# EAGLE design Xor_Not (EAGLE 7.6.0)
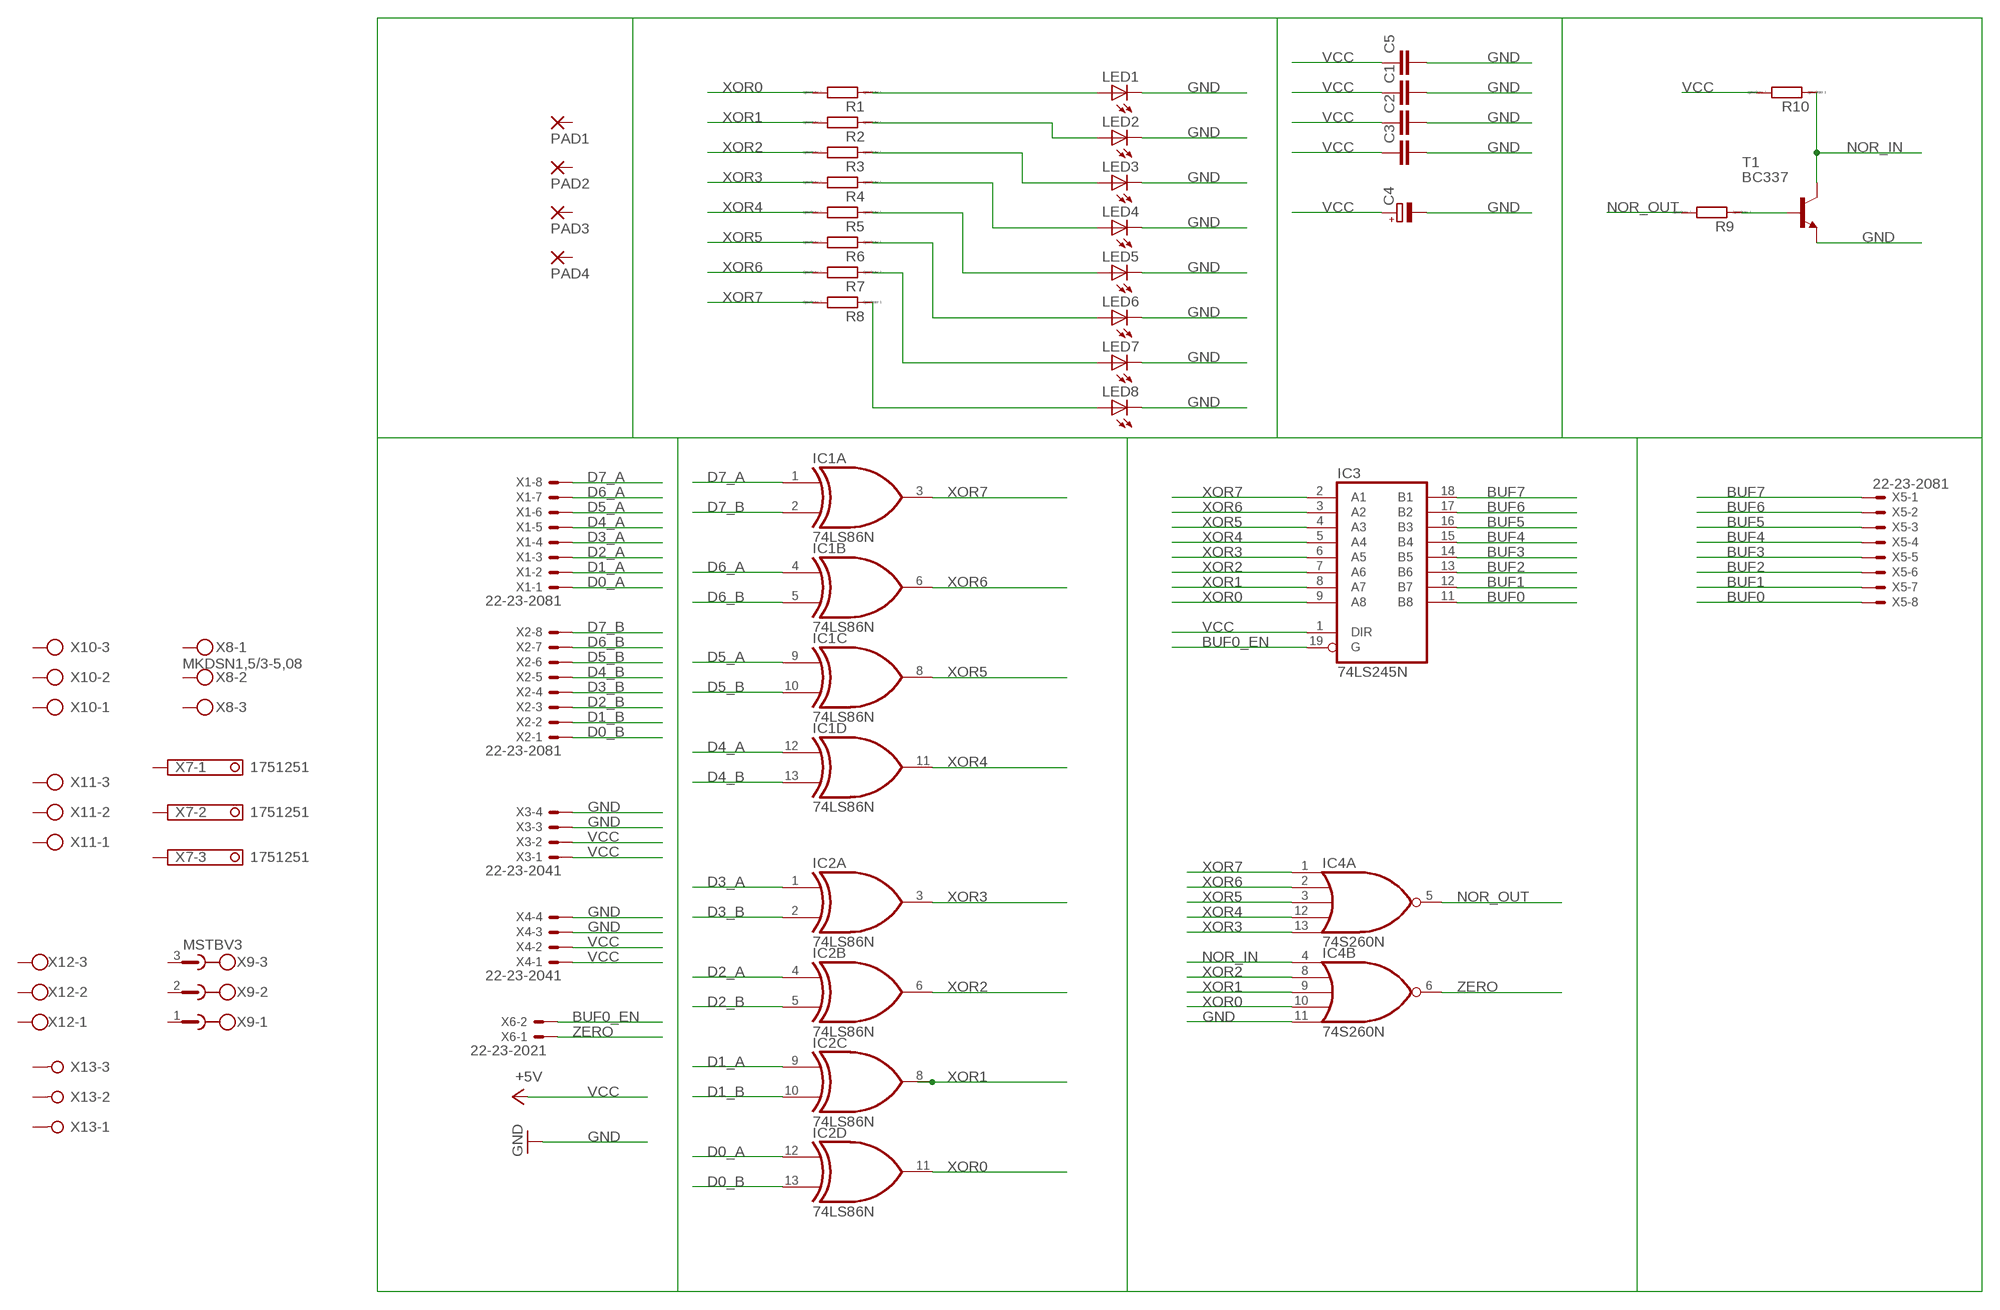
[diagram p0: schematic, sheet 1]

## Parts
C1  C-EU025-025X050  [C025-025X050]
C2  C-EU025-025X050  [C025-025X050]
C3  C-EU025-025X050  [C025-025X050]
C4  CPOL-EUE2.5-6  [E2,5-6]
C5  C-EU025-025X050  [C025-025X050]
IC1  74LS86N  [DIL14]
IC2  74LS86N  [DIL14]
IC3  74LS245N  [DIL20]
IC4  74S260N  [DIL14]
LED1  LED5MM  [LED5MM]
LED2  LED5MM  [LED5MM]
LED3  LED5MM  [LED5MM]
LED4  LED5MM  [LED5MM]
LED5  LED5MM  [LED5MM]
LED6  LED5MM  [LED5MM]
LED7  LED5MM  [LED5MM]
LED8  LED5MM  [LED5MM]
PAD1  3,17/1,3  [3,17/1,3]
PAD2  3,17/1,3  [3,17/1,3]
PAD3  3,17/1,3  [3,17/1,3]
PAD4  3,17/1,3  [3,17/1,3]
R1  R0207/10  [0207/10]
R2  R0207/10  [0207/10]
R3  R0207/10  [0207/10]
R4  R0207/10  [0207/10]
R5  R0207/10  [0207/10]
R6  R0207/10  [0207/10]
R7  R0207/10  [0207/10]
R8  R0207/10  [0207/10]
R9  R0207/10  [0207/10]
R10  R0207/10  [0207/10]
T1  BC337  [TO92]
X1  22-23-2081  [22-23-2081]
X2  22-23-2081  [22-23-2081]
X3  22-23-2041  [22-23-2041]
X4  22-23-2041  [22-23-2041]
X5  22-23-2081  [22-23-2081]
X6  22-23-2021  [22-23-2021]
X7  1751251  [1751251]
X8  MKDSN1,5/3-5,08  [MKDSN1,5/3-5,08]
X9  MSTBV3  [MSTBV3]
X10  AK300/3  [AK300/3]
X11  AK500/3-H  [AK500/3-H]
X12  W237-103  [W237-103]
X13  W237-03P  [W237-133]

## Nets
BUF0: IC3.11(B8) X5.8
BUF0_EN: IC3.19(G) X6.2
BUF1: IC3.12(B7) X5.7
BUF2: IC3.13(B6) X5.6
BUF3: IC3.14(B5) X5.5
BUF4: IC3.15(B4) X5.4
BUF5: IC3.16(B3) X5.3
BUF6: IC3.17(B2) X5.2
BUF7: IC3.18(B1) X5.1
D0_A: IC2.12(D:I0) X1.1
D0_B: IC2.13(D:I1) X2.1
D1_A: IC2.9(C:I0) X1.2
D1_B: IC2.10(C:I1) X2.2
D2_A: IC2.4(B:I0) X1.3
D2_B: IC2.5(B:I1) X2.3
D3_A: IC2.1(A:I0) X1.4
D3_B: IC2.2(A:I1) X2.4
D4_A: IC1.12(D:I0) X1.5
D4_B: IC1.13(D:I1) X2.5
D5_A: IC1.9(C:I0) X1.6
D5_B: IC1.10(C:I1) X2.6
D6_A: IC1.4(B:I0) X1.7
D6_B: IC1.5(B:I1) X2.7
D7_A: IC1.1(A:I0) X1.8
D7_B: IC1.2(A:I1) X2.8
GND [suply]: C1.2 C2.2 C3.2 C4.- C5.2 IC4.11(B:I4) LED1.K(C) LED2.K(C) LED3.K(C) LED4.K(C) LED5.K(C) LED6.K(C) LED7.K(C) LED8.K(C) T1.1(E) X3.3 X3.4 X4.3 X4.4
N$15: R9.1 T1.2(B)
N$74: LED1.A R1.1
N$75: LED2.A R2.1
N$76: LED3.A R3.1
N$77: LED4.A R4.1
N$78: LED5.A R5.1
N$79: LED6.A R6.1
N$80: LED7.A R7.1
N$81: LED8.A R8.1
NOR_IN: IC4.4(B:I0) R10.1 T1.3(C)
NOR_OUT: IC4.5(A:O) R9.2
VCC [suply]: C1.1 C2.1 C3.1 C4.+ C5.1 IC3.1(DIR) R10.2 X3.1 X3.2 X4.1 X4.2 ; supply symbol labelled +5V
XOR0: IC2.11(D:O) IC3.9(A8) IC4.10(B:I3) R1.2
XOR1: IC2.8(C:O) IC3.8(A7) IC4.9(B:I2) R2.2
XOR2: IC2.6(B:O) IC3.7(A6) IC4.8(B:I1) R3.2
XOR3: IC2.3(A:O) IC3.6(A5) IC4.13(A:I4) R4.2
XOR4: IC1.11(D:O) IC3.5(A4) IC4.12(A:I3) R5.2
XOR5: IC1.8(C:O) IC3.4(A3) IC4.3(A:I2) R6.2
XOR6: IC1.6(B:O) IC3.3(A2) IC4.2(A:I1) R7.2
XOR7: IC1.3(A:O) IC3.2(A1) IC4.1(A:I0) R8.2
ZERO: IC4.6(B:O) X6.1
Unconnected: PAD1.1(P) PAD2.1(P) PAD3.1(P) PAD4.1(P) X7.1 X7.2 X7.3 X8.1 X8.2 X8.3 X9.1 X9.2 X9.3 X10.1 X10.2 X10.3 X11.1 X11.2 X11.3 X12.1 X12.2 X12.3 X13.1 X13.2 X13.3

## Power pins joined to a net without a drawn wire
GND: IC1.7(P:GND) IC2.7(P:GND) IC3.10(GND) IC4.7(P:GND)
VCC: IC1.14(P:VCC) IC2.14(P:VCC) IC3.20(VCC) IC4.14(P:VCC)

## Library data of the parts
C1-C3 C5 = resistor:C-EU: CAPACITOR, European symbol
C4 = resistor:CPOL-EU: POLARIZED CAPACITOR, European symbol
IC1 IC2 = 74xx-us:74*86: Quad 2-input EXCLUSIV-OR (XOR) gate
IC3 = 74xx-us:74*245: Octal BUS TRANSCEIVER, 3-state
IC4 = 74xx-us:74*260: Dual 5-input positive NOR gate
LED1-LED8 = led:LED: LED OSRAM: - CHIPLED LG R971, LG N971, LY N971, LG Q971, LY Q971, LO R971, LY R971 LH N974, LH R974 LS Q976, LO Q976, LY Q976 LO Q996 - Hyper CHIPLED LW Q18S LB Q993, LB Q99A, LB R99A - SideLED LS A670, LO A670, LY A670, LG A670, LP A670 LB A673, LV A673, LT A673, LW A673 LH A674 LY A675 LS A676, LA A676, LO A676, LY A676, LW A676 LS A679, LY A679, LG A679 - Hyper Micro SIDELED® LS Y876, LA Y876, LO Y876, LY Y876 LT Y87S - SmartLED LW L88C, LW L88S LB L89C, LB L89S, LG L890 LS L89K, LO L89K, LY L89K LS L896, LA L896, LO L896, LY L896 - TOPLED LS T670, LO T670, LY T670, LG T670, LP T670 LSG T670, LSP T670, LSY T670, LOP T670, LYG T670 LG T671, LOG T671, LSG T671 LB T673, LV T673, LT T673, LW T673 LH T674 LS T676, LA T676, LO T676, LY T676, LB T676, LH T676, LSB T676, LW T676 LB T67C, LV T67C, LT T67C, LS T67K, LO T67K, LY T67K, LW E67C LS E67B, LA E67B, LO E67B, LY E67B, LB E67C, LV E67C, LT E67C LW T67C LS T679, LY T679, LG T679 LS T770, LO T770, LY T770, LG T770, LP T770 LB T773, LV T773, LT T773, LW T773 LH T774 LS E675, LA E675, LY E675, LS T675 LS T776, LA T776, LO T776, LY T776, LB T776 LHGB T686 LT T68C, LB T68C - Hyper Mini TOPLED® LB M676 - Mini TOPLED Santana® LG M470 LS M47K, LO M47K, LY M47K Source: http://www.osram.convergy.de LUXEON: - LUMILED® LXK2-PW12-R00, LXK2-PW12-S00, LXK2-PW14-U00, LXK2-PW14-V00 LXK2-PM12-R00, LXK2-PM12-S00, LXK2-PM14-U00 LXK2-PE12-Q00, LXK2-PE12-R00, LXK2-PE12-S00, LXK2-PE14-T00, LXK2-PE14-U00 LXK2-PB12-K00, LXK2-PB12-L00, LXK2-PB12-M00, LXK2-PB14-N00, LXK2-PB14-P00, LXK2-PB14-Q00 LXK2-PR12-L00, LXK2-PR12-M00, LXK2-PR14-Q00, LXK2-PR14-R00 LXK2-PD12-Q00, LXK2-PD12-R00, LXK2-PD12-S00 LXK2-PH12-R00, LXK2-PH12-S00 LXK2-PL12-P00, LXK2-PL12-Q00, LXK2-PL12-R00 Source: www.luxeon.com KINGBRIGHT: KA-3528ASYC Source: www.kingbright.com
PAD1-PAD4 = wirepad:3,17/1,3: THROUGH-HOLE PAD
R1-R10 = eagle-ltspice:R: RESISTOR, European symbol; SPICEMODEL: NONE; SPICEPREFIX: R
T1 = transistor:BC337: NPN TRANSISTOR
X1 X2 X5 = con-molex:22-23-2081: .100" (2.54mm) Center Header - 8 Pin; MF: MOLEX; MPN: 22-23-2081; OC_FARNELL: 1756826; OC_NEWARK: 01C7592
X3 X4 = con-molex:22-23-2041: .100" (2.54mm) Center Header - 4 Pin; MF: MOLEX; MPN: 22-23-2041; OC_FARNELL: 1462920; OC_NEWARK: 38C0355
X6 = con-molex:22-23-2021: .100" (2.54mm) Center Header - 2 Pin; MF: MOLEX; MPN: 22-23-2021; OC_FARNELL: 1462926; OC_NEWARK: 25C3832
X7 = con-phoenix-350:1751251: MKDS 1/ 3-3,5 Printklemme Nennstrom: 10 A Bemessungsspannung: 160 V Raster: 3,5 mm Polzahl: 3 Montageart: Löten Anschlussart: Schraubanschluss Anschlussrichtung vom Leiter zur Platine: 0° Source: http://eshop.phoenixcontact.com .. 1751251.pdf; OC_FARNELL: unknown; OC_NEWARK: unknown
X8 = con-phoenix-508:MKDSN1,5/3-5,08: MKDSN 1,5/ 3-5,08 Printklemme Nennstrom: 13,5 A Nennspannung: 250 V Rastermaß: 5,08 mm Polzahl: 3 Anschlussart: Schraubanschluss Montage: Löten Anschlussrichtung Leiter/Platine: 0 ° Artikelnummer: 1729131 Source: http://eshop.phoenixcontact.com .. 1729131.pdf
X9 = con-phoenix-508:MSTBV3: PHOENIX; MPN: MSTBV 2,5/3-GF-5.08; OC_FARNELL: 1792793; OC_NEWARK: 69R9846
X10 = con-ptr500:AK300/3: CONNECTOR; OC_FARNELL: unknown; OC_NEWARK: unknown
X11 = con-ptr500:AK500/3-H: CONNECTOR Aug. 2004 / PTR Meßtechnik: Die Bezeichnung der Serie AK505 wurde geändert. Es handelt sich hierbei um AK500 in horizontaler Ausführung.; OC_FARNELL: unknown; OC_NEWARK: unknown
X12 = con-wago-500:W237-103: WAGO SCREW CLAMP; MPN: 237-103; OC_FARNELL: unknown; OC_NEWARK: 18M7116
X13 = con-wago-508:W237-03P: WAGO SREW CLAMP; OC_FARNELL: unknown; OC_NEWARK: unknown

## Net classes
1 suply: width 1.016 mm

## Board
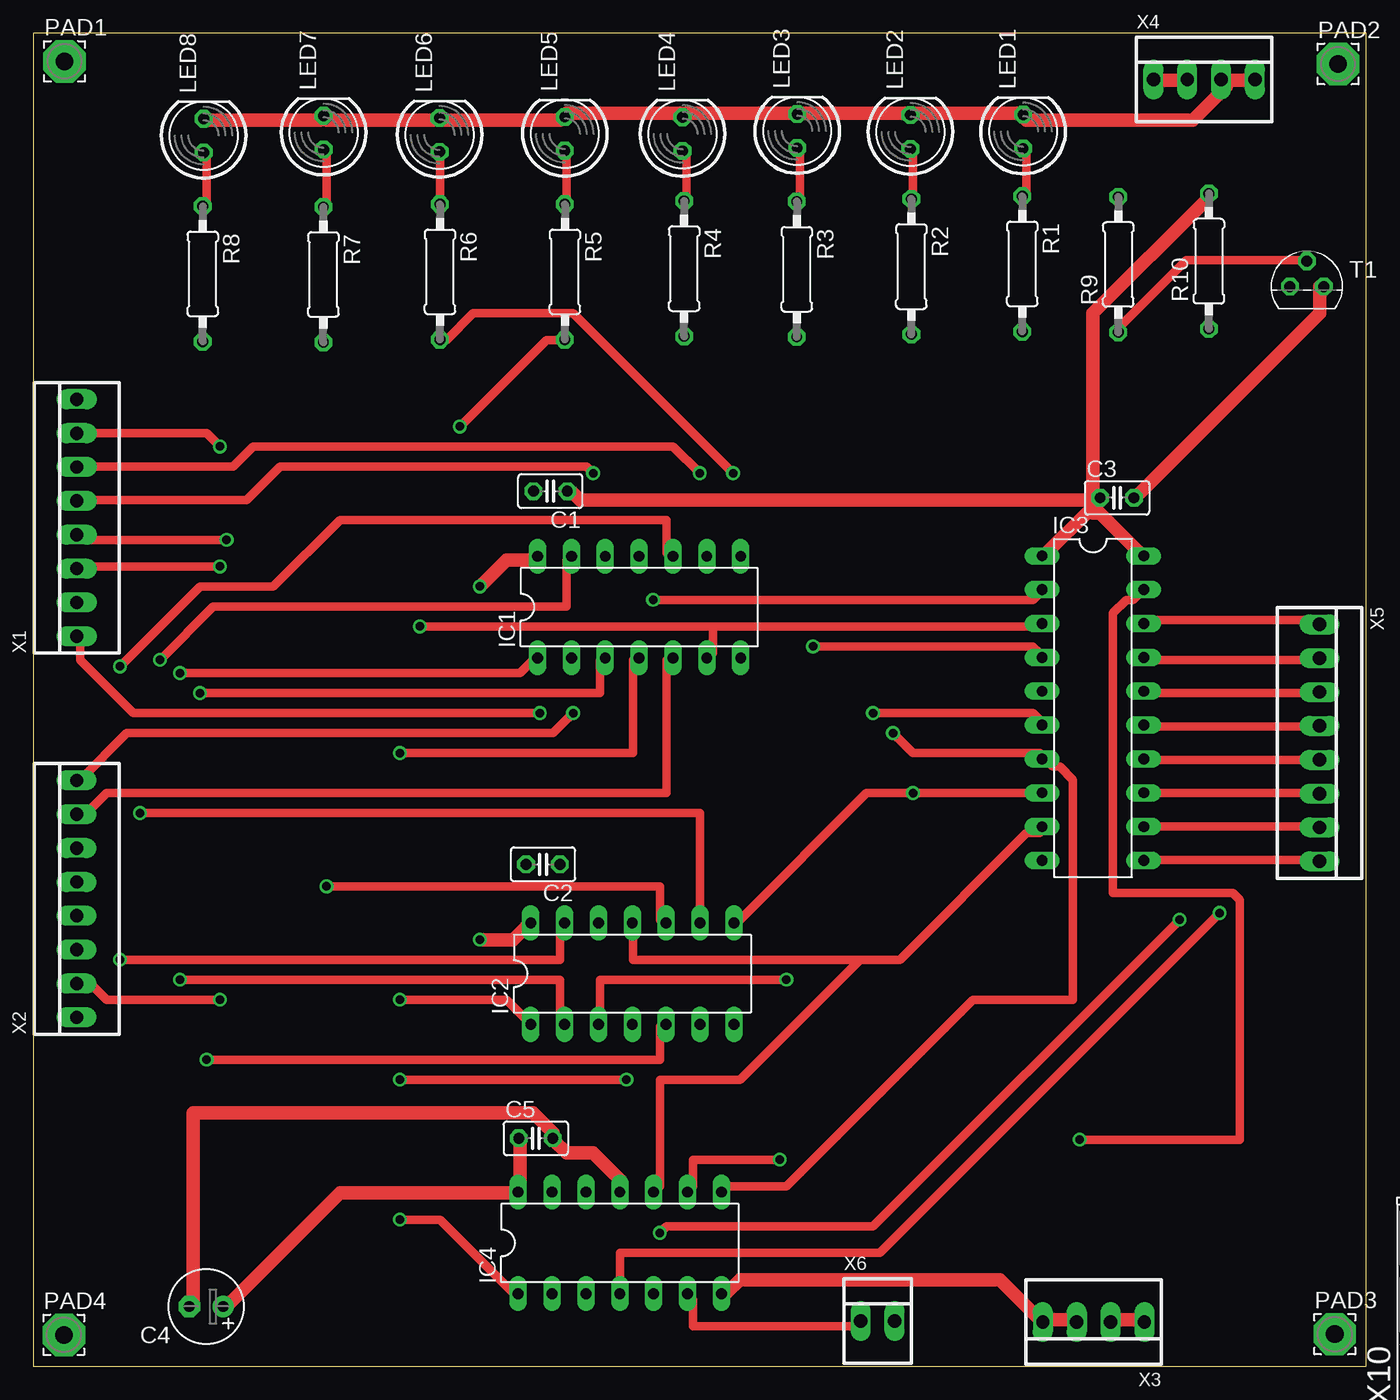
[diagram p1: board, top side]
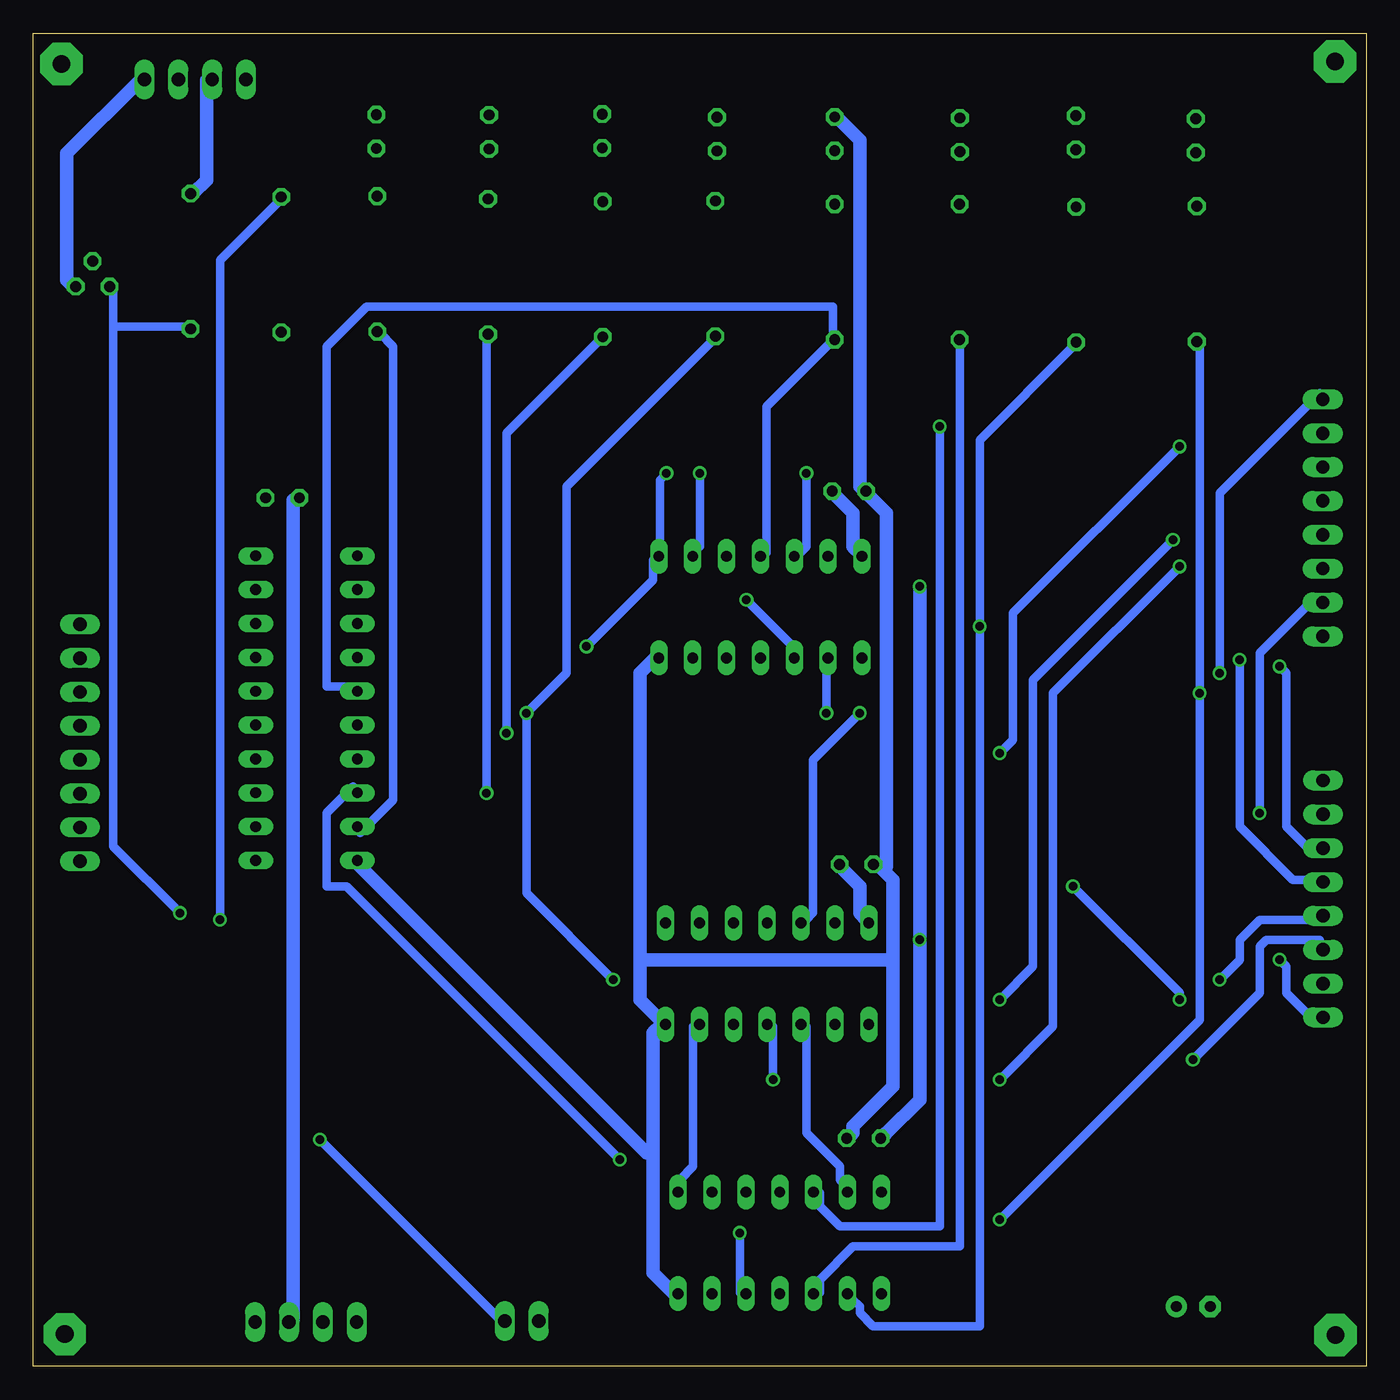
[diagram p2: board, bottom side, seen from below]

Size 100 x 100 mm. Coordinates in mm from the lower left corner, seen from the top.
Outline: 0,0 100,0 100,100 0,100 0,0
Copper layers (1*16): Top 0.035mm / dielectric 1.5mm / Bottom 0.035mm
Design rules "default *": minimum track width 25mil, minimum drill 25mil, track to track 25mil, track to pad 25mil, pad to pad 25mil, via to via 25mil, smd to smd 8mil, copper to edge 40mil, drill to drill 8mil, minimum pad ring 10mil, minimum via ring 8mil, stop-mask expansion 4mil, vias tented up to drill 0mil, thermal gap 10mil

### Footprints (pad centres in the part's own frame; a part is rotated, then mirrored left to right if it is on the bottom)
C025-025X050 = drill 0.813 octagon: 1 -1.27,0; 2 1.27,0
E2,5-6 = drill 0.813 pad 1.6: + -1.27,0 | drill 0.813 pad 1.6 octagon: - 1.27,0
DIL14 = drill 0.813 long: 1 -7.62,-3.81; 2 -5.08,-3.81; 3 -2.54,-3.81; 4 0,-3.81; 5 2.54,-3.81; 6 5.08,-3.81; 7 7.62,-3.81; 8 7.62,3.81; 9 5.08,3.81; 10 2.54,3.81; 11 0,3.81; 12 -2.54,3.81; 13 -5.08,3.81; 14 -7.62,3.81
DIL20 = drill 0.813 long: 1 -11.43,-3.81; 2 -8.89,-3.81; 3 -6.35,-3.81; 4 -3.81,-3.81; 5 -1.27,-3.81; 6 1.27,-3.81; 7 3.81,-3.81; 8 6.35,-3.81; 9 8.89,-3.81; 10 11.43,-3.81; 11 11.43,3.81; 12 8.89,3.81; 13 6.35,3.81; 14 3.81,3.81; 15 1.27,3.81; 16 -1.27,3.81; 17 -3.81,3.81; 18 -6.35,3.81; 19 -8.89,3.81; 20 -11.43,3.81
LED5MM = drill 0.813 octagon: A -1.27,0; K 1.27,0
3,17/1,3 = drill 1.321 pad 3.175 octagon: 1 0,0
0207/10 = drill 0.813 octagon: 1 -5.08,0; 2 5.08,0
TO92 = drill 0.813 octagon: 1 1.27,0; 2 0,1.905; 3 -1.27,0
22-23-2081 = drill 1 long: 1 -8.89,0; 2 -6.35,0; 3 -3.81,0; 4 -1.27,0; 5 1.27,0; 6 3.81,0; 7 6.35,0; 8 8.89,0
22-23-2041 = drill 1 long: 1 -3.81,0; 2 -1.27,0; 3 1.27,0; 4 3.81,0
22-23-2021 = drill 1 long: 1 -1.27,0; 2 1.27,0
1751251 = drill 1.1 pad 1.7: 1 -3.5,-0.1; 2 0,-0.1; 3 3.5,-0.1
MKDSN1,5/3-5,08 = drill 1.3 pad 2: 1 -7.641,0.025; 2 -2.561,0.025; 3 2.519,0.025
MSTBV3 = drill 1.397 long: 1 -5.08,0; 2 0,0; 3 5.08,0
AK300/3 = drill 1.321 long: 1 -5.004,0; 2 0,0; 3 5.004,0
AK500/3-H = drill 1.321 long: 1 -5.004,0; 2 0,0; 3 5.004,0
W237-103 = drill 1.194 long: 1 -5,-1.29; 2 0,-1.29; 3 5,-1.29
W237-133 = drill 1.194 long: 1 -5.08,-0.635; 2 0,-0.635; 3 5.08,-0.635

### Placement (x,y rotation side)
C1  38.79,65.65 180 top
C2  38.24,37.65 180 top
C3  81.31,65.15 0 top
C4  12.97,4.48 180 top
C5  37.7,17.1 0 top
IC1  45.45,56.95 0 top
IC2  44.94,29.45 0 top
IC3  79.5,49.37 270 top
IC4  44,9.25 0 top
LED1  74.26,92.63 90 top
LED2  65.81,92.6 90 top
LED3  57.31,92.67 90 top
LED4  48.71,92.44 90 top
LED5  39.88,92.46 90 top
LED6  30.48,92.38 90 top
LED7  21.78,92.55 90 top
LED8  12.78,92.32 90 top
PAD1  2.34,97.9 0 top
PAD2  97.89,97.7 0 top
PAD3  97.64,2.4 0 top
PAD4  2.29,2.35 0 top
R1  74.2,82.7 270 top
R2  65.88,82.5 270 top
R3  57.28,82.3 270 top
R4  48.83,82.35 270 top
R5  39.88,82.1 270 top
R6  30.51,82.1 270 top
R7  21.76,81.9 270 top
R8  12.71,81.95 270 top
R9  81.4,82.65 90 top
R10  88.2,82.9 90 top
T1  95.55,81 0 top
X1  3.26,63.65 90 top
X2  3.25,35.06 90 top
X3  79.55,3.32 180 top
X4  87.85,96.55 0 top
X5  96.5,46.77 270 top
X6  63.35,3.4 0 top
X7  135.35,22 90 top  (outside the outline)
X8  109.15,22.8 90 top  (outside the outline)
X9  115.55,20.05 90 top  (outside the outline)
X10  108.55,4.6 90 top  (outside the outline)
X11  105.65,-11.9 90 top  (outside the outline)
X12  128,19.85 270 top  (outside the outline)
X13  123.2,3.05 90 top  (outside the outline)

### Tracks (layer width: path | path; a pad name or v marks a point on that pad's centre or on a via)
BUF0
  Top 0.635: IC3.11 83.5,38 96.5,38 X5.8
BUF0_EN  (via drill 0.64)
  Top 0.635: v78.5,17 90.5,17 90.5,35 90,35.5 81,35.5 81,56.5 82,57.5 82.5,57.5 83,58 IC3.19
  Bottom 0.635: v78.5,17 65,3.5 X6.2
BUF1
  Top 0.635: IC3.12 83.5,40.5 96.5,40.5 X5.7
BUF2
  Top 0.635: IC3.13 83.5,43 96.5,43 X5.6
BUF3
  Top 0.635: X5.5 83.5,45.5 IC3.14
BUF4
  Top 0.635: IC3.15 83.5,48 96.5,48 X5.4
BUF5
  Top 0.635: IC3.16 83.5,50.5 96.5,50.5 X5.3
BUF6
  Top 0.635: IC3.17 83.5,53 96.5,53 X5.2
BUF7
  Top 0.635: IC3.18 83.5,56 96.5,56 X5.1
D0_A  (via drill 0.64)
  Top 0.635: v38,49 7.5,49 3.5,53 3.5,54.5 X1.1
  Bottom 0.635: v38,49 41.5,45.5 41.5,34 42,33.5 IC2.12
D0_B  (via drill 0.64)
  Top 0.635: v6.5,30.5 39.5,30.5 39.5,33 IC2.13
  Bottom 0.635: v6.5,30.5 6,30 6,28 4.5,26.5 3.5,26.5 X2.1
D1_A  (via drill 0.64)
  Top 0.635: v8,41.5 50,41.5 50,33.5 IC2.9
  Bottom 0.635: v8,41.5 8,53.5 4.5,57 3.5,57 X1.2
D1_B  (via drill 0.64)
  Top 0.635: v22,36 47,36 47,33.5 IC2.10 | v14,27.5 5.5,27.5 4.5,28.5 3.5,28.5 X2.2
  Bottom 0.635: v22,36 14,28 v14,27.5
D2_A  (via drill 0.64)
  Top 0.635: v27.5,21.5 v44.5,21.5 | v14,60 3.5,60 X1.3
  Bottom 0.635: v44.5,21.5 44.5,25.5 IC2.4 | v27.5,21.5 23.5,25.5 23.5,50.5 v14,60
D2_B  (via drill 0.64)
  Top 0.635: v13,23 47,23 47,25.5 IC2.5
  Bottom 0.635: v13,23 8,28 8,31.5 7.5,32 3.5,32 3.5,31.5 X2.3
D3_A  (via drill 0.64)
  Top 0.635: v27.5,27.5 35.5,27.5 37,26 IC2.1 | v14.5,62 3.5,62 X1.4
  Bottom 0.635: v27.5,27.5 25,30 25,51.5 v14.5,62
D3_B  (via drill 0.64)
  Top 0.635: v11,29 39.5,29 39.5,26 IC2.2
  Bottom 0.635: v11,29 9.5,30.5 9.5,32 8,33.5 3.5,33.5 X2.4
D4_A  (via drill 0.64)
  Top 0.635: v42,67 41.5,67.5 18.5,67.5 16,65 3.5,65 X1.5
  Bottom 0.635: v42,67 42,61.5 42.5,61 IC1.12
D4_B  (via drill 0.64)
  Top 0.635: v9.5,53 13.5,57 40,57 40,60.5 IC1.13
  Bottom 0.635: v9.5,53 9.5,40.5 5.5,36.5 3.5,36.5 X2.5
D5_A  (via drill 0.64)
  Top 0.635: v50,67 48,69 16.5,69 15,67.5 3.5,67.5 X1.6
  Bottom 0.635: v50,67 50,61.5 50.5,61 IC1.9
D5_B  (via drill 0.64)
  Top 0.635: v6.5,52.5 12.5,58.5 18,58.5 23,63.5 47.5,63.5 47.5,61 IC1.10
  Bottom 0.635: v6.5,52.5 6,52 6,40.5 4.5,39 3.5,39 X2.6
D6_A  (via drill 0.64)
  Top 0.635: v27.5,46 45,46 45,53 IC1.4 | v14,69 13,70 X1.7
  Bottom 0.635: v27.5,46 26.5,47 26.5,56.5 v14,69
D6_B
  Top 0.635: IC1.5 47.5,53 47.5,43 5.5,43 4,41.5 3.5,41.5 X2.7
D7_A  (via drill 0.64)
  Top 0.635: v11,52 36.5,52 37.5,53 IC1.1
  Bottom 0.635: v11,52 11,65.5 3.5,73 X1.8
D7_B  (via drill 0.64)
  Top 0.635: v40.5,49 39,47.5 7,47.5 3.5,44 X2.8
  Bottom 0.635: v40.5,49 40.5,53 IC1.2
GND
  Top 1.016: C3.2 83,65.5 96.5,79 96.5,81 T1.1 | LED8.K 13,93.5 21.5,93.5 LED7.K 22,93.5 30,93.5 LED6.K 30.5,93.5 39.5,93.5 LED5.K 40,94 48.5,94 LED4.K 49,94 57,94 LED3.K 57.5,94 65.5,94 LED2.K 66,94 74,94 LED1.K 74.5,93.5 87,93.5 89.5,96 X4.3 89.5,96.5 91.5,96.5 X4.4 | X3.3 78,3.5 76,3.5 X3.4 75.5,3.5 72.5,6.5 53,6.5 52,5.5 IC4.7 | IC4.11 44,14 42,16 40,16 39,17 C5.2 39,17.5 37.5,19 12,19 12,4.5 C4.-
  Bottom 1.016: T1.1 97,81 97.5,81.5 97.5,91 92,96.5 X4.4 | 53.5,16 53.5,25 53,25.5 IC2.7 53,26 54.5,27.5 54.5,30.5 | 53.5,16 53.5,7 52,5.5 IC4.7 | 54.5,30.5 54.5,52 53.5,53 IC1.7 | IC3.10 75.5,37.5 54,16 53.5,16 | 36.25,37.25 35.5,36.5 35.5,30.5 | 36.25,37.25 36.5,37.5 C2.2 | 35.5,30.5 35.5,21 38.5,18 38.5,17.5 C5.2 | 36.25,37.25 36,37.5 36,64 37.5,65.5 C1.2 38,66 38,92 39.5,93.5 LED5.K | 35.5,30.5 54.5,30.5
N$15
  Top 0.635: R9.1 81.5,78 86.5,83 95.5,83 T1.2
N$74
  Top 0.635: R1.1 74.5,88 74.5,91 LED1.A
N$75
  Top 0.635: LED2.A 66,91 66,88 R2.1
N$76
  Top 0.635: R3.1 57.5,87.5 57.5,91 LED3.A
N$77
  Top 0.635: R4.1 49,87.5 49,91 LED4.A
N$78
  Top 0.635: R5.1 40,87.5 40,91 LED5.A
N$79
  Top 0.635: LED6.A 30.5,91 30.5,87.5 R6.1
N$80
  Top 0.635: R7.1 22,87 22,91 LED7.A
N$81
  Top 0.635: R8.1 13,87.5 13,91 LED8.A
NOR_IN  (via drill 0.64)
  Top 0.635: IC4.4 44,8.5 63.5,8.5 v89,34
  Bottom 0.635: v89,34 94,39 94,78 | 94,78 94,81 T1.3 | 94,78 88.5,78 R10.1
NOR_OUT  (via drill 0.64)
  Top 0.635: v47,10 47.5,10.5 63,10.5 v86,33.5
  Bottom 0.635: v47,10 47,5.5 IC4.5 | v86,33.5 86,83 81.5,87.5 R9.2
VCC  (via drill 0.64)
  Top 1.016: C5.1 36.5,17 36.5,13.5 IC4.14 36,13 23,13 14.5,4.5 C4.+ | v33.5,32 36,32 37,33 IC2.14 | X4.1 84.5,96.5 86.5,96.5 X4.2 | X3.2 81,3.5 83,3.5 X3.1 | 79.25,64.25 80,65 C3.1 | 79.25,64.25 76,61 IC3.1 | IC3.20 83,61 80,64 79.5,64 79.25,64.25 | C1.1 40.5,65.5 41,65 79.5,65 C3.1 | R10.2 88,87.5 79.5,79 79.5,65.5 C3.1 | v33.5,58.5 35.5,60.5 37.5,60.5 IC1.14
  Bottom 1.016: IC2.14 37.5,33.5 38,34 38,36 39.5,37.5 C2.1 | C5.1 36,17.5 33.5,20 v33.5,32 v33.5,58.5 | R10.2 88,88 87,89 87,96.5 X4.2 | IC1.14 38,61 38.5,61.5 38.5,64 40,65.5 C1.1 | X3.2 80.5,3.5 80.5,65 C3.1
XOR0
  Top 0.635: 62,30.5 65,30.5 74.5,40 75.5,40 IC3.9 | 62,30.5 45,30.5 45,33 IC2.11 | 62,30.5 53,21.5 47,21.5 47,13.5 IC4.10
  Bottom 0.635: R1.2 74,77.5 73,76.5 73,42.5 75.5,40 IC3.9
XOR1  (via drill 0.64)
  Top 0.635: v56,15.5 49.5,15.5 49.5,13.5 IC4.9 | IC2.8 53,33.5 62.5,43 v66,43 75.5,43 IC3.8
  Bottom 0.635: v56,15.5 76.5,36 78,36 78,41.5 76,43.5 IC3.8 | v66,43 66,77 R2.2
XOR2  (via drill 0.64)
  Top 0.635: IC4.8 52,13.5 56.5,13.5 70.5,27.5 78,27.5 78,44 77,45 76.5,45 76,45.5 IC3.7 75.5,46 66,46 v64.5,47.5
  Bottom 0.635: IC2.6 50.5,25.5 50.5,15 51.5,14 51.5,13.5 IC4.8 | R3.2 64.5,70 v64.5,47.5
XOR3  (via drill 0.64)
  Top 0.635: v63,49 75,49 75.5,48.5 IC3.6 | v56.5,29 42.5,29 42.5,26 IC2.3
  Bottom 0.635: IC4.13 39,13.5 39.5,14 39.5,15 42,17.5 42,25.5 IC2.3 | R4.2 49,77 60,66 60,52 v63,49 63,35.5 v56.5,29
XOR4  (via drill 0.64)
  Top 0.635: v32,70.5 38.5,77 39.5,77 R5.2
  Bottom 0.635: v32,70.5 32,10.5 39.5,10.5 41,12 41,13 IC4.12 | IC1.11 45,61 45,72 40,77 R5.2 40,77.5 40,79.5 75,79.5 78,76.5 78,51 76,51 IC3.5
XOR5  (via drill 0.64)
  Top 0.635: v52.5,67 40.5,79 33,79 31,77 R6.2 | v58.5,54 75,54 75.5,53.5 IC3.4
  Bottom 0.635: v52.5,67 53,66.5 53,61 IC1.8 53.5,60.5 53.5,59 v58.5,54 | IC4.3 41,5.5 41,6.5 38.5,9 30.5,9 30.5,77 R6.2
XOR6  (via drill 0.64)
  Top 0.635: 51,55.5 51,53.5 IC1.6 | 51,55.5 75.5,55.5 IC3.3 | v29,55.5 51,55.5
  Bottom 0.635: IC4.2 38.5,5 38,4.5 38,4 37,3 29,3 v29,55.5 29,69.5 22,76.5 R7.2
XOR7  (via drill 0.64)
  Top 0.635: v27.5,11 30.5,11 36,5.5 IC4.1 | v12.5,50.5 42.5,50.5 42.5,53 IC1.3 | v46.5,57.5 75,57.5 75.5,58 IC3.2
  Bottom 0.635: v27.5,11 12.5,26 v12.5,50.5 12.5,76.5 R8.2 | v46.5,57.5 43,54 43,53.5 IC1.3
ZERO
  Top 0.635: IC4.6 49.5,5 49.5,3 62,3 X6.1